# EAGLE design CO2SN v2 (EAGLE 9.6.2)
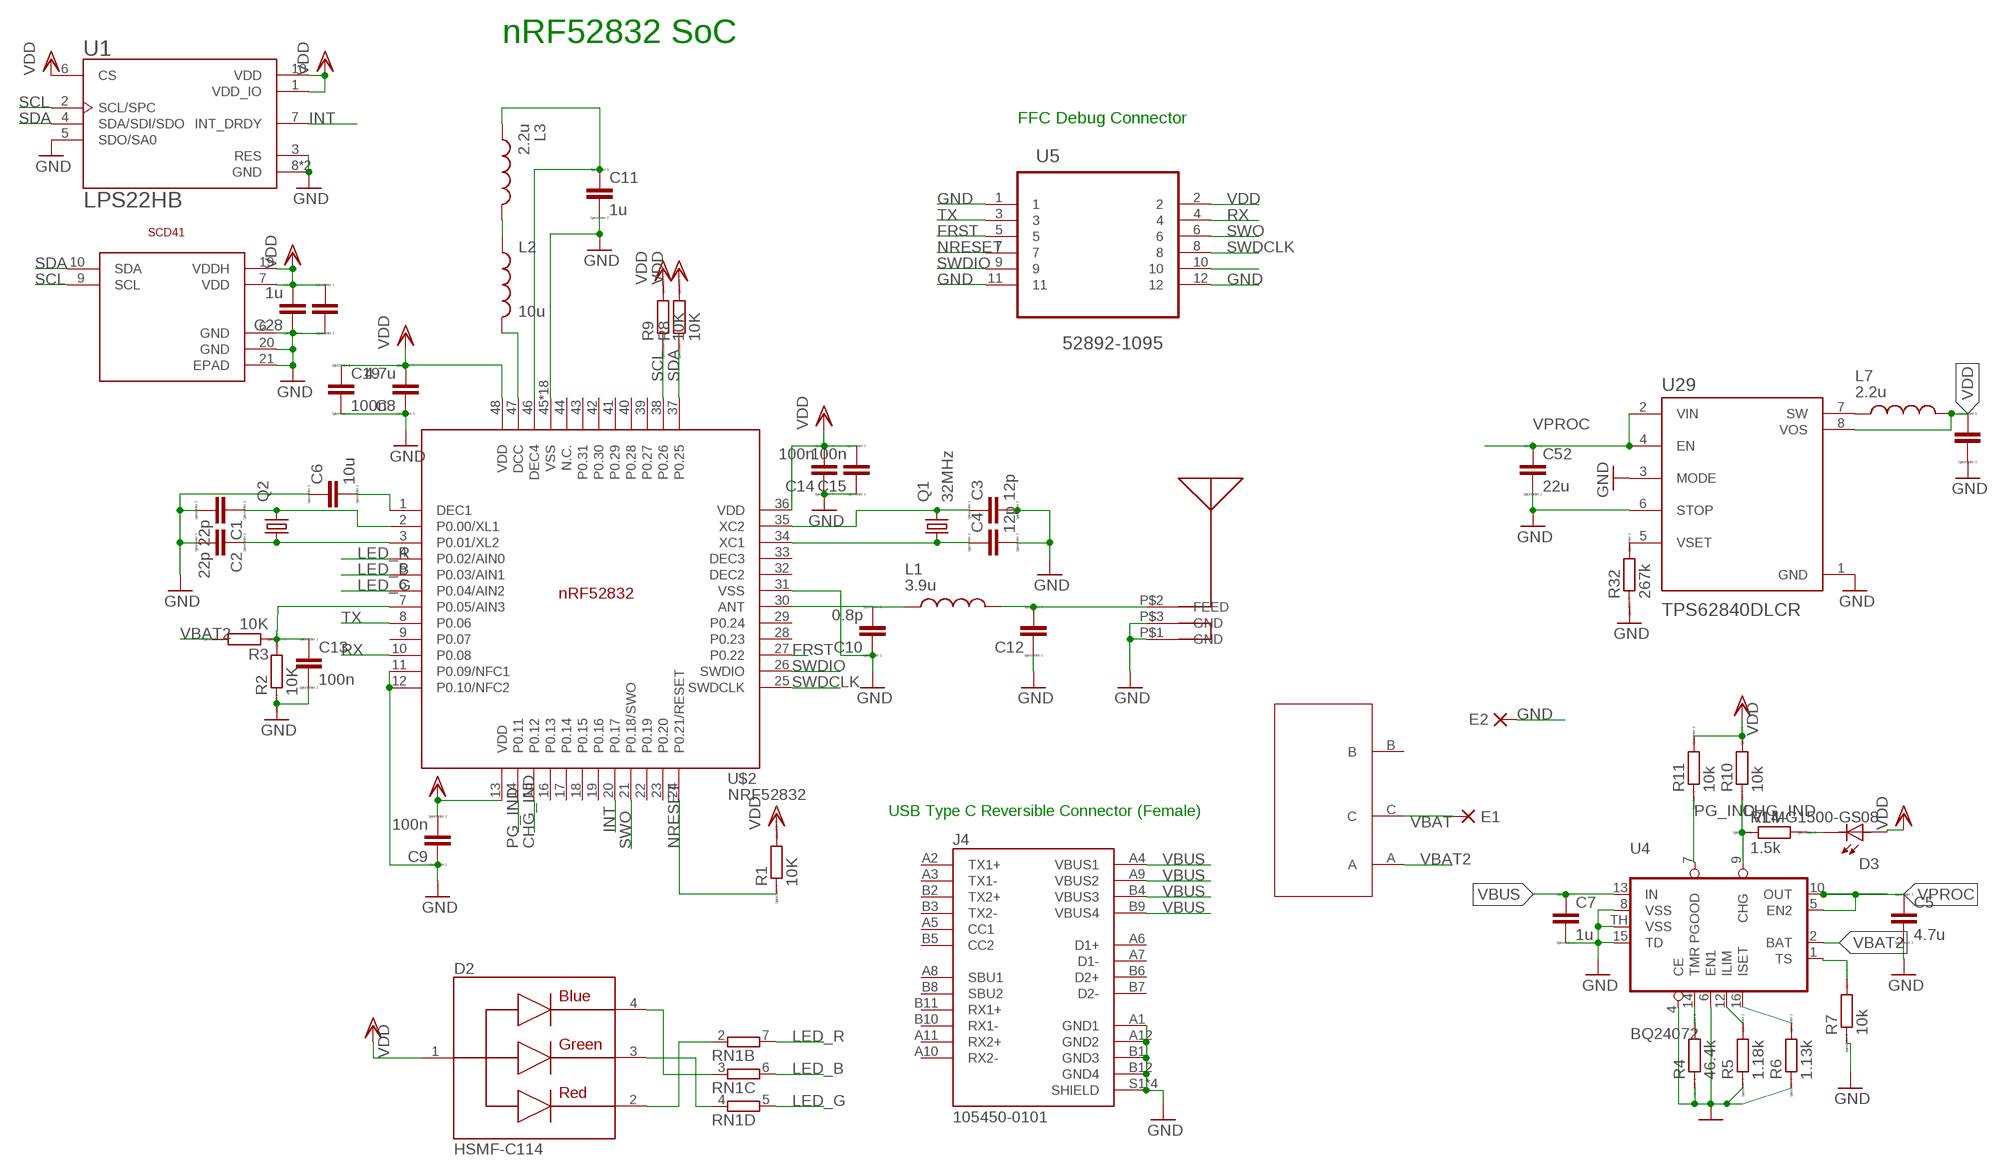
[diagram p0: schematic, sheet 1]

## Parts
C1  22p  CC0402  [C0402]
C2  22p  CC0402  [C0402]
C3  12p  CC0402  [C0402]
C4  12p  CC0402  [C0402]
C5  4.7u  CC0402  [C0402]
C6  10u  CC0402  [C0402]
C7  1u  CC0402  [C0402]
C8  4.7u  CC0402  [C0402]
C9  100n  CC0603R  [C0603R]
C10  0.8p  CC0402  [C0402]
C11  1u  CC0402  [C0402]
C12  1.2p  CC0402  [C0402]
C13  100n  CC0402  [C0402]
C14  100n  CC0402  [C0402]
C15  100n  CC0402  [C0402]
C19  100n  CC0402  [C0402]
C28  1u  CC0402  [C0402]
C29  22u  CC0603R  [C0603R]
C52  22u  CC0603R  [C0603R]
C58  22u  CC0603R  [C0603R]
D2  HSMF-C114  [DIOSC160X150X35-4N]
D3  VLMG1500-GS08  [LEDC1005X35N]
E1  DPADS_PAD-0400-S  [DPADS_0400-S]
E2  DPADS_PAD-0400-S  [DPADS_0400-S]
J4  105450-0101  [MOLEX_105450-0101]
L1  3.9u  MHQ0402P7N5JT000  [INDC0402X26N]
L2  10u  INDUCTOR  [L0603]
L3  2.2u  MHQ0402P7N5JT000  [INDC0402X26N]
L7  2.2u  1277AS-H-1R5M=P2  [INDC3225X120N]
Q1  32MHz  KX-5  [2.0X1.6_KX-5]
Q2  KX-327-RT  [2.0X1.2]
R1  10K  RR0402  [R0402]
R2  10K  RR0402  [R0402]
R3  10K  RR0402  [R0402]
R4  46.4k  RR0402  [R0402]
R5  1.18k  RR0402  [R0402]
R6  1.13k  RR0402  [R0402]
R7  10k  RR0402  [R0402]
R8  10K  RR0402  [R0402]
R9  10K  RR0402  [R0402]
R10  10k  RR0402  [R0402]
R11  10k  RR0402  [R0402]
R14  1.5k  RR0402  [R0402]
R32  267k  RR0402  [R0402]
RN1  4R-N0402ARV341  [4X0402ARV341]
U1  LPS22HB  [LGA10R50P2X3_200X200X80]
U4  BQ24072  [S-PVQFN-N16]
U5  52892-1095  [MOLEX_52892-1095]
U29  TPS62840DLCR  [SON50P200X150X100-8N]
U$1  SCD41  [SCD41]
U$2  NRF52832  [QFN40P600X600X90-48_N]
U$3  SMDTOGGLESWITCH  [SMDTOGGLESWITCH]
U$4  CHIPANTENNAL2  [CHIPANTENNAL2]

## Nets
CHG_IND: R10.1 R14.1 U4.9(CHG) U$2.15(P0.12)
FRST: U5.5 U$2.27(P0.22)
GND: C1.2 C2.2 C3.2 C4.2 C5.2 C6.1 C7.2 C8.1 C9.1 C10.1 C11.2 C12.1 C13.2 C14.1 C15.1 C19.2 C28.1 C29.2 C52.2 C58.2 E2.PAD(P) J4.A1(GND1) J4.A12(GND2) J4.B1(GND3) J4.B12(GND4) J4.S1(SHIELD) J4.S2(SHIELD) J4.S3(SHIELD) J4.S4(SHIELD) R2.1 R4.1 R5.1 R6.1 R7.1 R32.1 U1.3(RES) U1.5(SDO/SA0) U1.8(GND) U1.9(GND) U4.4(CE) U4.6(EN1) U4.8(VSS) U4.15(TD) U4.TH(VSS) U5.1 U5.11 U5.12 U29.1(GND) U29.3(MODE) U29.6(STOP) U$1.6(GND) U$1.20(GND) U$1.21(EPAD) U$2.11(P0.09/NFC1) U$2.12(P0.10/NFC2) U$2.31(VSS) U$2.45(VSS) U$2.PAD(VSS) U$2.PAD@VIA01(VSS) U$2.PAD@VIA02(VSS) U$2.PAD@VIA03(VSS) U$2.PAD@VIA04(VSS) U$2.PAD@VIA05(VSS) U$2.PAD@VIA06(VSS) U$2.PAD@VIA07(VSS) U$2.PAD@VIA08(VSS) U$2.PAD@VIA09(VSS) U$2.PAD@VIA10(VSS) U$2.PAD@VIA11(VSS) U$2.PAD@VIA12(VSS) U$2.PAD@VIA13(VSS) U$2.PAD@VIA14(VSS) U$2.PAD@VIA15(VSS) U$2.PAD@VIA16(VSS) U$4.P$1(GND) U$4.P$3(GND)
INT: U1.7(INT_DRDY) U$2.20(P0.17)
LED_B: RN1.6 U$2.5(P0.03/AIN1)
LED_G: RN1.5 U$2.6(P0.04/AIN2)
LED_R: RN1.7 U$2.4(P0.02/AIN0)
N$1: C1.1 Q2.2 U$2.2(P0.00/XL1)
N$2: C2.1 Q2.1 U$2.3(P0.01/XL2)
N$3: C3.1 Q1.3 U$2.35(XC2)
N$4: C4.1 Q1.1 U$2.34(XC1)
N$5: L2.2 U$2.47(DCC)
N$6: C10.2 L1.1 U$2.30(ANT)
N$7: C6.2 U$2.1(DEC1)
N$8: R4.2 U4.14(TMR)
N$9: R5.2 U4.12(ILIM)
N$10: L2.1 L3.2
N$11: C11.1 L3.1 U$2.46(DEC4)
N$12: R6.2 U4.16(ISET)
N$13: U5.10
N$14: D2.2 RN1.2
N$15: D3.2 R14.2
N$17: C13.1 R2.2 R3.1 U$2.7(P0.05/AIN3)
N$20: D2.3 RN1.4
N$21: D2.4 RN1.3
N$80: L7.1 U29.7(SW)
N$94: R32.2 U29.5(VSET)
NRESET: R1.1 U5.7 U$2.24(P0.21/RESET)
PG_IND: R11.1 U4.7(PGOOD) U$2.14(P0.11)
RF: C12.2 L1.2 U$4.P$2(FEED)
RX: U5.4 U$2.10(P0.08)
SCL: R9.1 U1.2(SCL/SPC) U$1.9(SCL) U$2.38(P0.26)
SDA: R8.1 U1.4(SDA/SDI/SDO) U$1.10(SDA) U$2.37(P0.25)
SWDCLK: U5.8 U$2.25(SWDCLK)
SWDIO: U5.9 U$2.26(SWDIO)
SWO: U5.6 U$2.21(P0.18/SWO)
TS: R7.2 U4.1(TS)
TX: U5.3 U$2.8(P0.06)
VBAT [PWRINFL]: E1.PAD(P) U$3.C
VBAT2: R3.2 U4.2(BAT) U$3.A
VBUS: C7.1 J4.A4(VBUS1) J4.A9(VBUS2) J4.B4(VBUS3) J4.B9(VBUS4) U4.13(IN)
VDD: C8.2 C9.2 C14.2 C15.2 C19.1 C28.2 C29.1 C58.1 D2.1 D3.1 L7.2 R1.2 R8.2 R9.2 R10.2 R11.2 U1.1(VDD_IO) U1.6(CS) U1.10(VDD) U5.2 U29.8(VOS) U$1.7(VDD) U$1.19(VDDH) U$2.13(VDD) U$2.36(VDD) U$2.48(VDD)
VPROC [NCLS3V7]: C5.1 C52.1 U4.5(EN2) U4.10(OUT) U29.2(VIN) U29.4(EN)
Unconnected: J4.A2(TX1+) J4.A3(TX1-) J4.A5(CC1) J4.A6(D1+) J4.A7(D1-) J4.A8(SBU1) J4.A10(RX2-) J4.A11(RX2+) J4.B2(TX2+) J4.B3(TX2-) J4.B5(CC2) J4.B6(D2+) J4.B7(D2-) J4.B8(SBU2) J4.B10(RX1-) J4.B11(RX1+) RN1.1 RN1.8 U$2.9(P0.07) U$2.16(P0.13) U$2.17(P0.14) U$2.18(P0.15) U$2.19(P0.16) U$2.22(P0.19) U$2.23(P0.20) U$2.28(P0.23) U$2.29(P0.24) U$2.32(DEC2) U$2.33(DEC3) U$2.39(P0.27) U$2.40(P0.28) U$2.41(P0.29) U$2.42(P0.30) U$2.43(P0.31) U$2.44(N.C.) U$3.B

## Notes on the sheet
- nRF52832 SoC
- FFC Debug Connector
- USB Type C Reversible Connector (Female)

## Library data of the parts
C1-C8 C10-C15 C19 C28 = eagle-ltspice:C: CAPACITOR, European symbol; SPICEMODEL: NONE; SPICEPREFIX: C
C9 C29 C52 C58 = eagle-ltspice:C: CAPACITOR, European symbol
D2 = HSMF-C114:HSMF-C114: LED Tri-Color Blue/Green/Red 468nm/523nm/637nm 4-Pin Chip LED T/R; AVAILABILITY: Unavailable; DESCRIPTION: LED RGB DIFFUSED CHIP SMD; MF: Broadcom Limited; MP: HSMF-C114; PACKAGE: 0606 Broadcom; PRICE: None
D3 = VLMG1500-GS08:VLMG1500-GS08: 0402 GREEN 571nm 35MCD 65° Rectangle with Flat Top SMT LED; AVAILABILITY: Unavailable; DESCRIPTION: 0402 GREEN 571nm 35MCD 65° Rectangle with Flat Top SMT LED; MF: Vishay; MP: VLMG1500-GS08; PACKAGE: 0402 Vishay; PRICE: None
E1 E2 = 52101-101-REV-A:DPADS_PAD: WIRE PAD Standard US Drill Sizes and SMD pads; BOM: EXCLUDE
J4 = 105450-0101:105450-0101: USB Shielded I/O Receptacle; Type C; Right Angle; Surface Mount; Gold over Nickel; AVAILABILITY: Unavailable; DESCRIPTION: USB-C (USB TYPE-C) USB 3.1 (USB 3.1 Gen 2, Superspeed+) Receptacle Connector 24 Position Surface Mount, Right Angle; Through Hole; MF: Molex; MP: 1054500101; PACKAGE: None; PRICE: None
L1 L3 = MHQ0402P7N5JT000:MHQ0402P7N5JT000: 221 NH 5% GOLD TERMINAL; AVAILABILITY: Unavailable; DESCRIPTION: FIXED IND 7.5NH 200MA 1.2 OHM; MF: TDK; MP: MHQ0402P7N5JT000; PACKAGE: 0402 TDK; PRICE: None
L2 = BeagleBone_Blue_R3:INDUCTOR: Inductors Basic Inductor/Choke - 0603 and 1206. Footprints are not proven and vary greatly between part numbers. SRN6045- 33uH, 20% 1.4A
L7 = 1277AS-H-1R5M_P2:1277AS-H-1R5M=P2: Ind Metal Alloy Shielded 1.5uH 20% 1MHz Powdered Iron 2.6A 1210 T/R Check prices <https://pricing.snapeda.com/parts/1277AS-H-1R5M%3DP2/Murata/view-part?ref=eda>; AVAILABILITY: Warning; DESCRIPTION: Inductor with Inductance: 1.5uH Tol. +/-20%, Package: 1210 (3225); MF: Murata; MP: 1277AS-H-1R5M=P2; PACKAGE: 1210 Murata; PRICE: None; PURCHASE-URL: https://pricing.snapeda.com/search/part/1277AS-H-1R5M=P2/?ref=eda
Q1 = crystal-geyer_V1_0:KX: Quartz Crystals (MHz) SMD: KX - Serie Model Size l/w/h [mm] Frequency Range Frequency Stability Temp. Range [°C] Load Capacitance AECQ 200 availabel Datasheet KX-4 KX-5 KX-6 KX-7 KX-9A KX-9B KX-12A KX-12B KX-13 KX-20 KX-K KX-KS 1.6/1.2/0.3 2.0/1.6/0.45 2.5/2.0/0.55 3.2/2.5/0.8 5.0/3.2/1.0 5.0/3.2/1.1 6.0/3.5/1.1 6.0/3.5/1.0 7.0/5.0 /1.3 11.6/5.5/1.6 12.3/4.5/4.2 12.3/4.5/3.2 24.0 ~ 80.0 MHz 16.0 ~ 80.0 MHz 12.0 ~ 80.0 MHz 8.0 ~ 60.0 MHz 7,68 ~ 300,0 MHz 8,0 ~ 50,0 MHz 8,0 ~ 150,0 MHz 8,0 ~ 50,0 MHz 6,0 ~ 160,0 MHz 3,579 ~ 25,0 MHz 3,579 ~ 70,0 MHz 3,579 ~ 70,0 MHz ±10 … ±50ppm ±10 … ±50ppm ±10 … ±50ppm ±10 … ±50ppm ±10 … ±50ppm ±10 … ±50ppm ±10 … ±50ppm ±10 … ±50ppm ±10 … ±50ppm ±50ppm ±10 … ±50ppm ±10 … ±50ppm (*) -40°C …+85°C (*) -40°C …+125°C (*) -40°C …+125°C (*) -40°C …+125°C (*) -40°C …+105°C (*) -40°C …+105°C (*) -40°C …+125°C (*) -40°C …+105°C (*) -40°C …+105°C (*) -40°C …+105°C (*) -40°C …+85°C (*) -40°C …+85°C 8, 8…16 8, 8…16 10, 8…16 12, 7…20 16, 10…20 16, 10…20 16, 10…20 16, 12…20 16, 12…20 16, 12…20 16, 12…30 16, 12…30 - yes yes yes - - - - - - - - KX-4.pdf <http://www.geyer-electronic.de/uploads/tx_userartikelfrequenz/GEYER-KX-4.pdf> KX-5.pdf <http://www.geyer-electronic.de/uploads/tx_userartikelfrequenz/GEYER-KX-5.pdf> KX-6.pdf <http://www.geyer-electronic.de/uploads/tx_userartikelfrequenz/GEYER-KX-6.pdf> KX-7.pdf <http://www.geyer-electronic.de/uploads/tx_userartikelfrequenz/GEYER-KX-7.pdf> KX-9A.pdf <http://www.geyer-electronic.de/uploads/tx_userartikelfrequenz/GEYER-KX-9A.pdf> KX-9B.pdf <http://www.geyer-electronic.de/uploads/tx_userartikelfrequenz/GEYER-KX-9B.pdf> KX-12A.pdf <http://www.geyer-electronic.de/uploads/tx_userartikelfrequenz/GEYER-KX-12A.pdf> KX-12B.pdf <http://www.geyer-electronic.de/uploads/tx_userartikelfrequenz/GEYER-KX-12B.pdf> KX-13.pdf <http://www.geyer-electronic.de/uploads/tx_userartikelfrequenz/GEYER-KX-13.pdf> KX-20.pdf <http://www.geyer-electronic.de/uploads/tx_userartikelfrequenz/GEYER-KX-20.pdf> KX-K.pdf <http://www.geyer-electronic.de/uploads/tx_userartikelfrequenz/GEYER-KX-K.pdf> KX-KS.pdf <http://www.geyer-electronic.de/uploads/tx_userartikelfrequenz/GEYER-KX-KS.pdf> <http://www.geyer-electronic.de/fileadmin/template/img/logo-geyer-electronic.png> Details see: http://www.geyer-electronic.de/Frequenz-Produkte.9.0.html Created 2016-06-07, Hans Locher 2016 (C) Geyer Quartz Technology KX4,KX5,KX6,KX7,KX9A,KX9B,KX12A,KX12B,KX13,KX20,KXK,KXKS;1612;2016;2520;3225;5032;6035;7050;11655;12345;1,6x1,2;2,0x1,6;2,5x2,0;3,2x2,5;5,0x3,2;6,0x3,5;7,0x5,0;11,6x5,5;12,3x4,5;12,3x4,5;1.6x1.2;2.0x1.6;2.5x2.0;3.2x2.5;5.0x3.2;6.0x3.5;7.0x5.0;11.6x5.5;12.3x4.5;12.3x4.5;
Q2 = crystal-geyer_V1_0:KX-327: Tuning Fork Crystals (kHz) SMD: KX327 - Serie Model Size l/w/h [mm] Frequency Range Frequency Stability Temp. Range [°C] Load Capacitance AECQ 200 availabel Datasheet KX-327VT KX-327FT KX-327RT KX-327NHT KX-327NHF KX-327L KX-327S 1.25/1.05/0.5 1.6/1.0/0.5 2.0/1.2/0.6 3.2/1.5/0.8 3.2/1.5/0.8 7.0/1.5/1.4 8.2/3.8/2.5 32,768 kHz 32,768 kHz 32,768 kHz 32,768 kHz 32,768 kHz 32,768 kHz 32,768 kHz ±10 … ±20ppm ±10 … ±20ppm ±10 … ±20ppm ±10 … ±20ppm ±10 … ±20ppm ±10 … ±20ppm ±5 … ±20ppm (*) -40°C …+85°C (*) -40°C …+85°C (*) -40°C …+85°C (*) -40°C …+85°C (*) -40°C …+125°C (*) -40°C …+85°C (*) -40°C …+85°C 7/9/12,5 7/9/12,5 7/9/12,6 7/9/12,5 9/12,5 7/9/12,5 6/12,5 - - - - yes - - KX-327VT.pdf <http://www.geyer-electronic.de/uploads/tx_userartikelfrequenz/GEYER-KX-327VT.pdf> KX-327FT.pdf <http://www.geyer-electronic.de/uploads/tx_userartikelfrequenz/GEYER-KX-327FT.pdf> KX-327RT.pdf <http://www.geyer-electronic.de/uploads/tx_userartikelfrequenz/GEYER-KX-327RT.pdf> KX-327NHT.pdf <http://www.geyer-electronic.de/uploads/tx_userartikelfrequenz/GEYER-KX-327NHT.pdf> KX-327NHF.pdf <http://www.geyer-electronic.de/uploads/tx_userartikelfrequenz/GEYER-KX-327NHF.pdf> KX-327L.pdf <http://www.geyer-electronic.de/uploads/tx_userartikelfrequenz/GEYER-KX-327L.pdf> KX-327S.pdf <http://www.geyer-electronic.de/uploads/tx_userartikelfrequenz/GEYER-KX-327S.pdf> <http://www.geyer-electronic.de/fileadmin/template/img/logo-geyer-electronic.png> Details see: http://www.geyer-electronic.de/Frequenz-Produkte.9.0.html Created 2016-06-07, Hans Locher 2016 (C) Geyer Quartz Technology KX327VT,KX327FT,KX327RT,KX327NHT,KX327NHF,KX327S,KX327L;125105;1610;2012;3215;7015;8238;1,25x1,05,1.25x1.05;1,6x1,0,1.6x1.0;2,0x1,2,2.0x1.2;3,2x1,5,3.2x1.5;8,2x3,8,8.2x3.8,7.0x1.5,7,0x1,532.768kHz
R1-R11 R14 R32 = eagle-ltspice:R: RESISTOR, European symbol; SPICEMODEL: NONE; SPICEPREFIX: R
RN1 = resistor-dil:4R-N: Array Chip Resistor Source: RS Component / Phycomp; OC_FARNELL: unknown; OC_NEWARK: unknown
U1 = LPS22HB:LPS22HB: MEMS nano pressure sensor: 260-1260 hPa absolute digital output barometer Check prices <https://pricing.snapeda.com/parts/LPS22HB/STMicroelectronics/view-part?ref=eda>; AVAILABILITY: No availability data; DESCRIPTION: Pressure Sensor 3.77PSI ~ 18.27PSI (26kPa ~ 126kPa) Absolute 24 b 10-WFLGA Exposed Pad; MF: STMicroelectronics; MP: LPS22HB; PACKAGE: WFLGA-10 STMicroelectronics; PRICE: None
U4 = Simplex-ICs:BQ24072: TI BQ24072 - Li battery charger and power path management ic
U5 = 52892-1095:52892-1095: CONNECTOR, FPC, ZIF, 0.50MM, 10 WAY; AVAILABILITY: Unavailable; DESCRIPTION: Socket, r/a, Fpc, Zif, Smt, 10way; MF: Molex; MP: 52892-1095; PACKAGE: None; PRICE: None
U29 = TPS62840DLCR:TPS62840DLCR: None Check prices <https://snapeda.com/parts/TPS62840DLCR/Texas%20Instruments/view-part/?ref=eda> Check prices <https://pricing.snapeda.com/parts/TPS62840DLCR/Texas%20Instruments/view-part?ref=eda>; AVAILABILITY: Warning; DESCRIPTION: 60-nA IQ, 1.8-V to 6.5-VIN, high-efficiency 750-mA step-down converter 8-VSON-HR -40 to 125; MF: Texas Instruments; MP: TPS62840DLCR; PACKAGE: VSON-HR-8 Texas Instruments; PRICE: None; PURCHASE-URL: https://pricing.snapeda.com/search/part/TPS62840DLCR/?ref=eda
U$1 = SCD41:SCD41
U$2 = Nordic_nRF:NRF52832: nRF52832 Features Single chip, highly flexible, 2.4 GHz multi-protocol SoC 32-bit ARM Cortex-M4F Processor 1.7v to 3.6v operation 512kB flash + 64kB RAM Supports concurrent Bluetooth Smart/ANT protocol operation On-chip NFC tag for Out-of-Band (OOB) pairing Up to +4dBm output power -96dBm sensitivity, Bluetooth Smart Thread safe and run-time protected Event driven API On air compatible with nRF24L and nRF24AP series 2 data rates (2Mbps/1Mbps) PPI - maximum flexibility for power-efficient applications and code simplification Automated power management system with automatic power management of each peripheral Configurable I/O mapping for analog and digital I/O 3 x Master/Slave SPI 2 x Two-wire interface (I²C) UART (RTS/CTS) 3 x PWM AES HW encryption Real Time Counter (RTC) Digital microphone interface (PDM) On-chip balun Applications Internet of Things (IoT) Wearables SmartHome sensors Connected white goods Computer peripherals Voice-command smart remotes A4WP ‘Rezence’ wireless charging Beacons Sports and fitness sensors and hubs Connected health products Smart watches RC Toys Interactive games Building automation and sensor networks
U$3 = smdtoggleswitch:SMDTOGGLESWITCH
U$4 = CHIPANTENNA:CHIPANTENNAL2

## Board
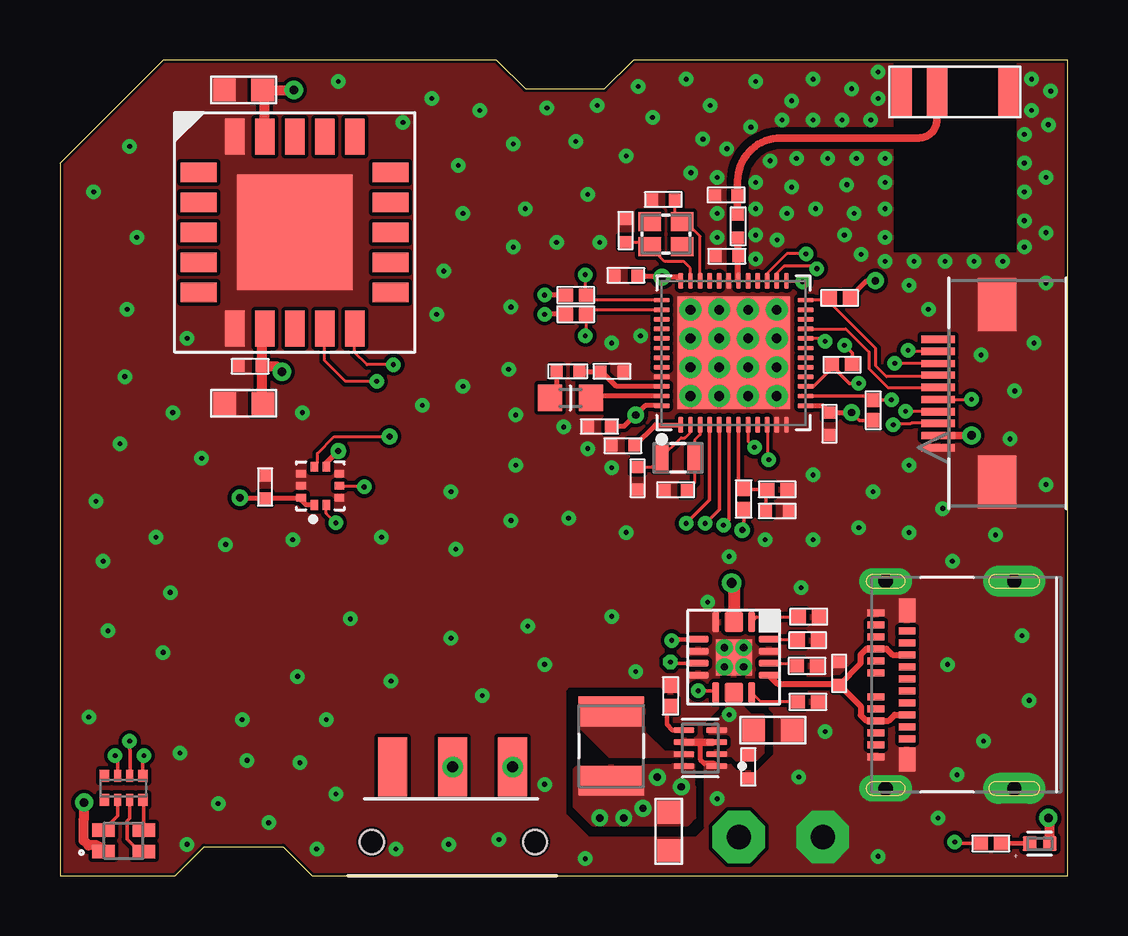
[diagram p1: board, top side]
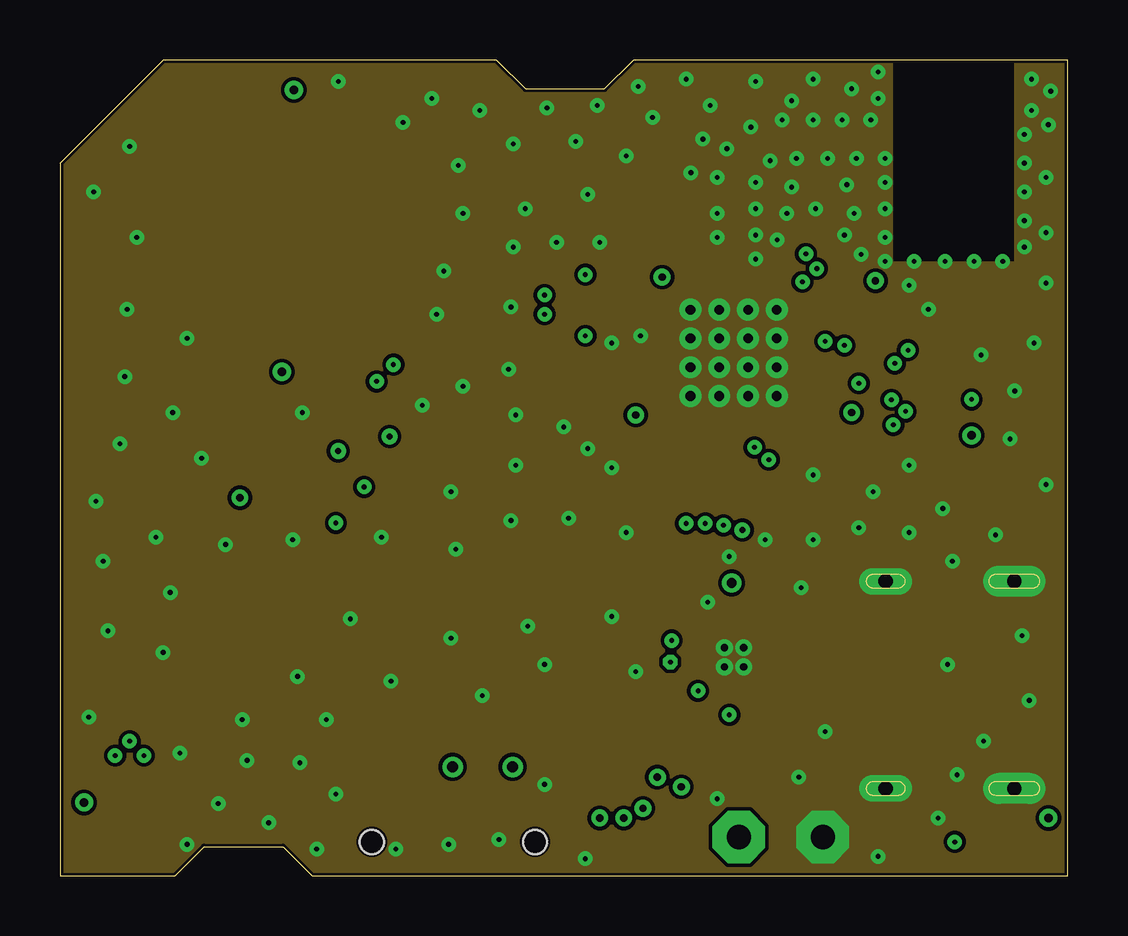
[diagram p2: board, inner layer Route2]
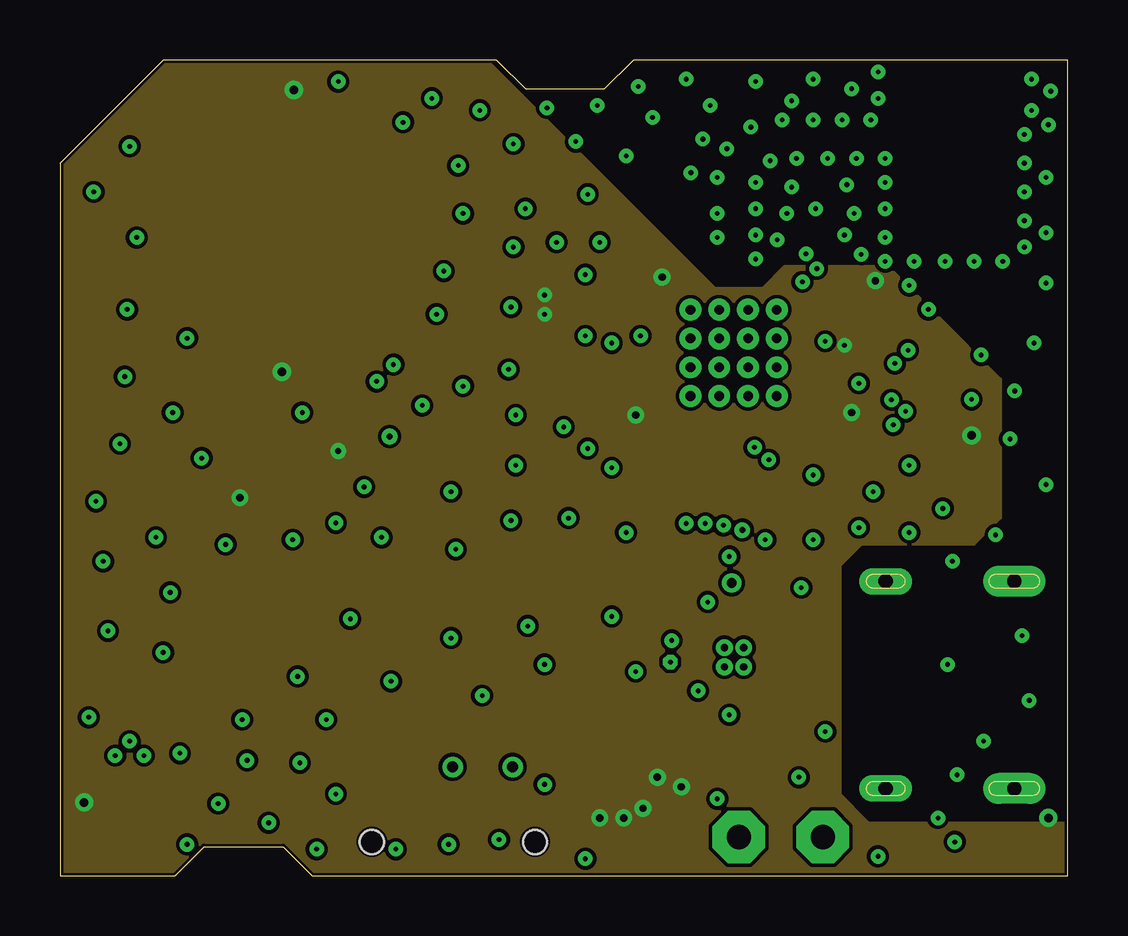
[diagram p3: board, inner layer Route15]
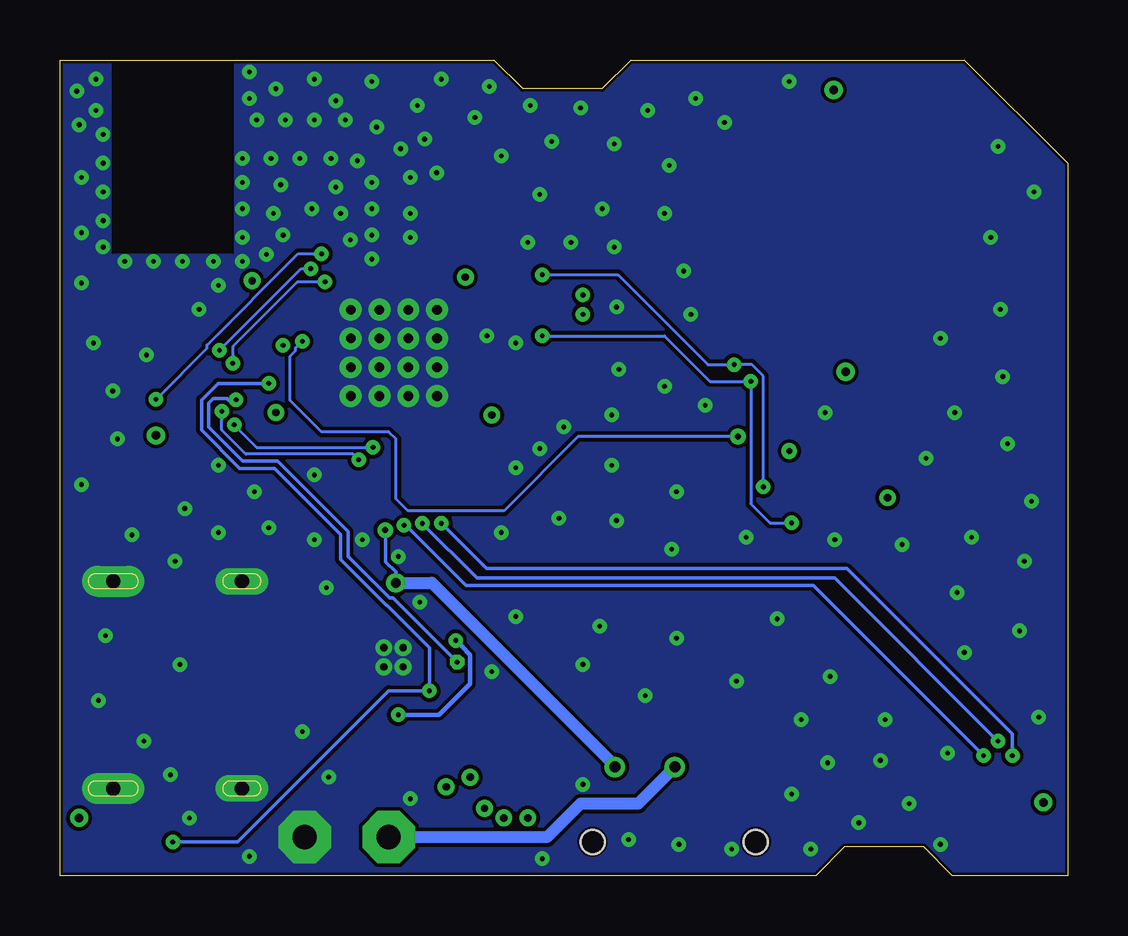
[diagram p4: board, bottom side, seen from below]

Size 42 x 34 mm. Coordinates in mm from the lower left corner, seen from the top.
Outline: 42,0 42,34 23.9,34 22.7,32.8 19.4,32.8 18.2,34 4.3,34 0,29.7 0,0 4.8,0 6,1.2 9.3,1.2 10.5,0 42,0
Copper layers (1+2*15+16): Top 0.035mm / dielectric 0.2mm / Route2 0.035mm / dielectric 0.45mm / Route15 0.035mm / dielectric 0.2mm / Bottom 0.035mm
Design rules "default *": minimum track width 5mil, minimum drill 0.2mm, track to track 6mil, track to pad 6mil, pad to pad 6mil, via to via 6mil, smd to smd 6mil, copper to edge 5mil, drill to drill 6mil, minimum pad ring 10mil, minimum via ring 8mil, stop-mask expansion 0mil, vias tented up to drill 40mil, thermal gap 0mil
tRestrict: 9 lines

### Footprints (pad centres in the part's own frame; a part is rotated, then mirrored left to right if it is on the bottom)
C0402 = smd 0.5 x 0.5: 1 -0.475,0; 2 0.475,0
C0603R = smd 0.95 x 0.95: 1 -0.85,0; 2 0.75,0
DIOSC160X150X35-4N = smd 0.94 x 0.57: 1 -0.845,-0.45; 2 -0.845,0.45; 3 0.845,0.45; 4 0.845,-0.45
LEDC1005X35N = smd 0.59 x 0.61: 1 -0.415,0; 2 0.415,0
DPADS_0400-S = drill 1.016 pad 2.184 octagon: PAD 0,0
MOLEX_105450-0101 = smd 0.3 x 0.7: A1 -3,3.77; A2 -2.5,3.77; A3 -2,3.77; A4 -1.5,3.77; A5 -1,3.77; A6 -0.5,3.77; A7 0.5,3.77; A8 1,3.77; A9 1.5,3.77; A10 2,3.77; A11 2.5,3.77; A12 3,3.77; B2 2.25,2.47; B3 1.75,2.47; B4 1.25,2.47; B5 0.75,2.47; B6 0.25,2.47; B7 -0.25,2.47; B8 -0.75,2.47; B9 -1.25,2.47; B10 -1.75,2.47; B11 -2.25,2.47 | smd 1 x 0.7: B1 3.1,2.47; B12 -3.1,2.47 | drill 0.6 pad 1.1 long: S1 -4.32,3.36; S2 4.32,3.36 | drill 0.6 pad 1.3 long: S3 -4.32,-2; S4 4.32,-2
INDC0402X26N = smd 0.5 x 0.5: 1 -0.732,0; 2 0.232,0
L0603 = smd 1 x 1.1: 1 -0.85,0; 2 0.85,0
INDC3225X120N = smd 1.24 x 2.72: 1 -1.44,0; 2 1.44,0
2.0X1.6_KX-5 = smd 0.95 x 0.8: 1 -0.675,-0.525; 2 0.675,-0.525; 3 0.675,0.525; 4 -0.675,0.525
2.0X1.2 = smd 0.6 x 1.1: 1 -0.7,0; 2 0.7,0
R0402 = smd 0.6 x 0.55: 1 -0.425,0; 2 0.425,0
4X0402ARV341 = smd 0.4 x 0.5: 1 -0.8,-0.5; 4 0.8,-0.5; 5 0.8,0.5; 8 -0.8,0.5 | smd 0.3 x 0.5: 2 -0.25,-0.5; 3 0.25,-0.5; 6 0.25,0.5; 7 -0.25,0.5
LGA10R50P2X3_200X200X80 = smd 0.4 x 0.3: 1 -0.8,0.25; 2 -0.8,-0.25; 6 0.8,-0.25; 7 0.8,0.25 | smd 0.3 x 0.4: 3 -0.5,-0.8; 4 0,-0.8; 5 0.5,-0.8; 8 0.5,0.8; 9 0,0.8; 10 -0.5,0.8
S-PVQFN-N16 = smd 0.85 x 0.28: 1 -0.725,2.225; 4 -0.725,0.725; 9 2.225,0.725; 12 2.225,2.225 | smd 0.85 x 0.78: 2 -0.725,1.475; 10 2.225,1.475 | smd 0.28 x 0.85: 5 0,0; 6 0.5,0; 7 1,0; 8 1.5,0; 13 1.5,2.95; 14 1,2.95; 15 0.5,2.95; 16 0,2.95 | smd 1.5 x 1.5: TH 0.75,1.475
MOLEX_52892-1095 = smd 0.305 x 1.397: 1 2.261,2.896; 2 1.753,2.896; 3 1.245,2.896; 4 0.762,2.896; 5 0.254,2.896; 6 -0.254,2.896; 7 -0.762,2.896; 8 -1.245,2.896; 9 -1.753,2.896; 10 -2.261,2.896 | smd 2.21 x 1.6: 11 -3.702,5.359; 12 3.702,5.359
SON50P200X150X100-8N = smd 0.86 x 0.27: 1 -0.685,0.75; 2 -0.685,0.25; 3 -0.685,-0.25; 4 -0.685,-0.75; 5 0.685,-0.75; 6 0.685,-0.25; 7 0.685,0.25; 8 0.685,0.75
SCD41 = smd 1.5 x 0.8: 1 0,0; 2 0,-1.25; 3 0,-2.5; 4 0,-3.75; 5 0,-5; 11 8,-5; 12 8,-3.75; 13 8,-2.5; 14 8,-1.25; 15 8,0 | smd 0.8 x 1.5: 6 1.5,-6.5; 7 2.75,-6.5; 8 4,-6.5; 9 5.25,-6.5; 10 6.5,-6.5; 16 6.5,1.5; 17 5.25,1.5; 18 4,1.5; 19 2.75,1.5; 20 1.5,1.5 | smd 4.8 x 4.8: 21 4,-2.5
QFN40P600X600X90-48_N = smd 0.65 x 0.2: 1 -3,2.2; 2 -3,1.8; 3 -3,1.4; 4 -3,1; 5 -3,0.6; 6 -3,0.2; 7 -3,-0.2; 8 -3,-0.6; 9 -3,-1; 10 -3,-1.4; 11 -3,-1.8; 12 -3,-2.2; 25 3,-2.2; 26 3,-1.8; 27 3,-1.4; 28 3,-1; 29 3,-0.6; 30 3,-0.2; 31 3,0.2; 32 3,0.6; 33 3,1; 34 3,1.4; 35 3,1.8; 36 3,2.2 | smd 0.2 x 0.65: 13 -2.2,-3; 14 -1.8,-3; 15 -1.4,-3; 16 -1,-3; 17 -0.6,-3; 18 -0.2,-3; 19 0.2,-3; 20 0.6,-3; 21 1,-3; 22 1.4,-3; 23 1.8,-3; 24 2.2,-3; 37 2.2,3; 38 1.8,3; 39 1.4,3; 40 1,3; 41 0.6,3; 42 0.2,3; 43 -0.2,3; 44 -0.6,3; 45 -1,3; 46 -1.4,3; 47 -1.8,3; 48 -2.2,3 | smd 4.7 x 4.7: PAD 0,0 | drill 0.4: PAD@VIA01 -1.8,1.8; PAD@VIA02 -1.8,0.6; PAD@VIA03 -1.8,-0.6; PAD@VIA04 -1.8,-1.8; PAD@VIA05 -0.6,1.8; PAD@VIA06 -0.6,0.6; PAD@VIA07 -0.6,-0.6; PAD@VIA08 -0.6,-1.8; PAD@VIA09 0.6,1.8; PAD@VIA10 0.6,0.6; PAD@VIA11 0.6,-0.6; PAD@VIA12 0.6,-1.8; PAD@VIA13 1.8,1.8; PAD@VIA14 1.8,0.6; PAD@VIA15 1.8,-0.6; PAD@VIA16 1.8,-1.8
SMDTOGGLESWITCH = smd 2.45 x 1.2: A 1.37,3.77; B 1.37,-1.23; C 1.37,1.27 | hole 1: 4.5,4.7; 4.5,-2.1
CHIPANTENNAL2 = smd 0.85 x 2: P$1 0.45,1; P$2 1.925,1; P$3 4.9,1

### Placement (x,y rotation side)
C1  24.08,16.56 270 top
C2  25.67,16.08 180 top
C3  23.58,26.89 90 top
C4  25.15,28.18 180 top
C5  28.69,4.53 270 top
C6  23.47,17.92 0 top
C7  32.48,8.43 90 top
C8  23.59,25.02 0 top
C9  7.71,19.68 0 top
C10  27.8,25.82 0 top
C11  23.01,21.02 0 top
C12  27.77,28.37 0 top
C13  29.9,15.2 0 top
C14  32.08,18.83 90 top
C15  22.49,18.72 0 top
C19  7.93,21.23 180 top
C28  8.55,16.2 270 top
C29  7.6,32.75 180 top
C52  29.77,6.06 0 top
C58  25.38,1.79 270 top
D2  2.65,1.45 0 top
D3  40.84,1.33 180 top
E1  28.3,1.6 0 top
E2  31.8,1.6 270 top
J4  37.78,7.95 90 top
L1  28.27,27.32 90 top
L2  21.28,19.91 0 top
L3  20.92,21.02 180 top
L7  22.98,5.4 270 top
Q1  25.26,26.74 180 top
Q2  25.76,17.42 180 top
R1  32.5,24.08 0 top
R2  29.9,16.1 180 top
R3  28.5,15.7 270 top
R4  31.14,8.74 180 top
R5  31.18,7.24 180 top
R6  31.17,9.81 180 top
R7  31.21,10.79 180 top
R8  21.5,24.2 180 top
R9  21.5,23.4 180 top
R10  32.6,21.3 0 top
R11  33.9,19.4 270 top
R14  38.8,1.34 0 top
R32  25.45,7.49 270 top
RN1  2.65,3.65 0 top
U1  10.85,16.25 90 top
U4  26.61,9.85 270 top
U5  33.7,20.1 270 top
U29  26.69,5.31 180 top
U$1  5.79,29.31 0 top
U$2  28.08,21.79 90 top
U$3  15.1,5.9 270 top
U$4  34.63,31.67 0 top

### Tracks (layer width: path | path; a pad name or v marks a point on that pad's centre or on a via)
CHG_IND  (via drill 0.2)
  Top 0.15: v33.3,20.52 32.91,20.52 32.5,20.93 32.5,20.98 R10.1 32.17,21.16 31.38,20.36 31.11,20.36 U$2.15
  Top 0.152: R14.1 37.36,1.34 v37.3,1.4 | v26.6,7.7 27.26,7.7 U4.9
  Bottom 0.15: v26.6,7.7 26.6,9.5 28.37,11.27 28.39,11.27 30.3,13.18 30.3,14.22 33.05,16.98 34.5,16.98 36.1,18.58 36.1,19.82 35.41,20.52 v33.3,20.52
  Bottom 0.152: v37.3,1.4 34.6,1.4 28.3,7.7 v26.6,7.7
FRST  (via drill 0.2)
  Top 0.127: U5.5 v38,19.85 | U$2.27 29.46,24.81 29.46,25.09 30.31,25.93 31.09,25.93 v31.1,25.92
  Bottom 0.127: v38,19.85 35.87,21.98 35.87,22.11 32.06,25.92 v31.1,25.92
GND  (via drill 0.2, 0.3)
  Top 0.2: U29.3 27.2,5.56 26.6,5.56 | U29.6 26.6,5.56 | U29.1 27.26,4.67 26.86,4.67 26.69,4.84 26.69,5.47 26.6,5.56
  Top 0.305: U29.6 27.2,5.56
  other vias: 29,25.7 29,26.7 27.4,26.6 29,27.8 27.4,27.6 27.4,29.1 29,28.9 29.6,29.8 27.8,30.3 28.8,31.2 30.7,29.9 30.1,31.5 31.4,31.5 32.6,31.5 32,29.9 33.2,29.9 33.8,31.5 34.4,29.9 34.4,28.9 34.4,27.8 34.4,26.6 34.4,25.6 35.6,25.6 36.9,25.6 38.1,25.6 39.3,25.6 40.2,26.2 40.2,27.3 40.2,28.5 40.2,29.7 40.2,30.9 40.5,31.9 40.5,33.2 34.1,32.4 34.1,33.5 33.4,25.9 33.1,27.6 41.1,26.8 32.7,26.7 41.2,31.3 41.1,29.1 30.3,27.6 32.8,28.8 41.3,32.7 33,32.8 35.4,24.6 31.4,33.2 29,33.1 27.1,32.1 30.5,28.7 26.3,29.3 26.1,33.2 23.6,30 31.5,27.8 36.2,23.6 41.1,24.7 29.9,26.5 30.5,32.3 24.2,22.5 22.5,26.4 22,28.4 21.5,30.6 19.4,27.8 22.4,32.1 24.1,32.9 20.3,32 20.7,26.4 18.9,30.5 31.4,16.7 33.3,14.5 38.4,21.7 41.1,16.3 39.8,20.2 39.6,18.2 36.8,15.3 19,19.2 40.6,22.2 23,22.2 23,17 33.9,16 35.4,14.3 23.6,14.3 30.9,12 35.4,17.1 39,14.2 31.4,14 22,17.8 21,18.7 29.4,14 31.9,6 27,11.4 27.9,13.3 23,10.8 24,8.5 30.8,4.1 38.5,5.6 37,8.8 26.8,30.7 24.7,31.6 18.7,21.1 18.9,26.2 21.2,14.9 16.8,20.4 37.2,13.1 15.7,23.4 37.4,4.2 36.6,2.4 1.5,15.6 16.8,27.6 34.1,0.8 40.1,10 15.1,19.6 17.5,31.9 15.5,32.4 11.6,33.1 18.8,23.7 19,17.1 16,25.2 18.8,14.8 16.3,16 9.7,14 13.4,14.1 6.9,13.8 4,14.1 10.1,19.3 5.9,17.4 2.5,18 4.7,19.3 2.7,20.8 2.8,23.6 1.4,28.5 2.9,30.4 3.2,26.6 27.4,3.2 20.2,3.8 40.4,7.3 14,1.1 1.2,6.6 18.3,1.5 17.6,7.5 5.3,22.4 1.8,13.1 5,5.1 16.5,13.6 21.9,0.7 16.2,1.3 8.7,2.2 10.7,1.1 10,4.7 11.5,3.4 20.2,8.8 5.3,1.3 13.8,8.1 11.1,6.5 7.8,4.8 6.6,3 2,10.2 7.6,6.5 4.6,11.8 9.9,8.3 16.3,9.9 12.1,10.7 19.5,10.4 4.3,9.3 28.5,9.5 28.5,8.7 27.7,8.7 27.7,9.5 14.3,31.4 16.6,29.6
  pour Top: 26.5,5.5 25.5,5.5 25.15,5.85 25.15,10.95 29.1,10.95 29.45,10.6 29.45,7.05 28.95,7.05 28.75,7.25 28.75,8.15 28.6,8.3 27.5,8.3 27.4,8.2 27.4,6.95 26.75,6.3 26.75,5.75
  pour Top: 26.9,2.05 26.9,4.6 27.95,4.6 28.2,4.35 29.1,4.35 29.8,5.05 29.8,6.75 29.3,7.25 28.95,7.25 28.95,10.95 41.95,10.95 41.95,-0.1 29.05,-0.1
  pour Top: 26.9,1.95 26.5,1.55 22.05,1.55 21.05,2.55 21.05,7.75 21.2,7.9 25.05,7.9 25.15,7.8 25.15,10.95 -0.1,10.95 -0.1,0.25 0.35,-0.2 36.95,-0.2 34.8,1.95
  pour Top: 42.05,10.8 42.05,25.9 34.7,25.9 34.7,34.1 0.05,34.1 0.05,10.8 0.1,10.75 42,10.75
  pour Top: 39.95,25.3 39.95,33.95 42.05,33.95 42.05,25.3
  pour Route2: -0.05,33.95 34.65,33.95 34.65,25.55 39.85,25.55 39.85,33.95 41.95,33.95 41.95,-0.1 36.9,-0.1 27.95,-9.05 -0.05,-9.05
  pour Bottom: 0.1,34.1 34.7,34.1 34.7,25.85 39.9,25.85 39.9,34 42.2,34 42.2,-0.1 0.1,-0.1
INT  (via drill 0.2, 0.25)
  Top 0.127: U1.7 10.73,17.18 10.73,17.6 11.43,18.3 v13.74,18.3 | v31.9,22.27 31.78,22.39 U$2.20
  Bottom 0.127: v13.74,18.3 20.4,18.3 23.5,15.2 27.5,15.2 28,15.7 28,18.2 28.3,18.5 31.1,18.5 32.4,19.8 32.4,21.67 32.18,21.89 32.18,21.99 v31.9,22.27
LED_B  (via drill 0.2)
  Top 0.152: RN1.6 2.93,4.18 2.93,5.22 2.9,5.25 v2.9,5.6 | v26.9,14.68 27.48,15.26 U$2.5
  Bottom 0.152: v2.9,5.6 9.7,12.4 24.62,12.4 v26.9,14.68
LED_G  (via drill 0.2)
  Top 0.152: RN1.5 3.45,4.95 v3.5,5 | U$2.6 27.88,14.82 v27.66,14.6
  Bottom 0.152: v3.5,5 10.59,12.1 25.07,12.1 27.57,14.6 v27.66,14.6
LED_R  (via drill 0.2)
  Top 0.152: v2.3,5 2.4,4.9 RN1.7 | v26.1,14.68 27.08,15.66 U$2.4
  Bottom 0.152: v2.3,5 2.3,5.9 9.2,12.8 24.22,12.8 v26.1,14.68
N$1
  Top 0.127: U$2.2 26.28,18.48 26.05,18.25 25.89,18.25 Q2.2 24.68,17.04 C1.1
N$2
  Top 0.127: U$2.3 26.68,18.38 26.45,18.15 Q2.1 26.46,16.39 C2.1
N$3
  Top 0.127: U$2.35 26.28,25.32 26,25.6 25.2,25.6 Q1.3 24.39,26.41 C3.1
N$4
  Top 0.127: U$2.34 26.68,26.65 26.07,27.27 Q1.1 25.62,27.57 C4.1
N$5
  Top 0.2: U$2.47 22.21,19.99 L2.2
N$6
  Top 0.254: U$2.30 28.27,25.6 C10.2 | C10.2 | C10.2
  Top 0.305: C10.2 L1.1
N$7
  Top 0.2: C6.2 24.82,18.79 U$2.1
N$8
  Top 0.127: U4.14 30.61,8.85 R4.2
N$9
  Top 0.127: R5.2 29.22,7.24 U4.12
N$10
  Top 0.2: L3.2 20.69,20.17 L2.1
N$11
  Top 0.2: U$2.46 23.21,20.39 22.58,21.02 C11.1 L3.1
N$12
  Top 0.127: U4.16 30.7,9.85 R6.2
N$14
  Top 0.152: D2.2 2.4,2.5 RN1.2
N$15
  Top 0.178: R14.2 40.41,1.34 D3.2
N$17
  Top 0.15: C13.1 29.43,16.05 R2.2
  Top 0.152: U$2.7 28.28,16.34 R3.1 28.52,16.1 R2.2
N$20
  Top 0.152: D2.3 3.5,3.1 RN1.4
N$21
  Top 0.152: RN1.3 2.9,2.38 2.8,2.28 2.8,1.5 3.3,1 D2.4
N$80
  pour Top: 26.4,4.95 22.9,4.95 21.65,6.2 21.65,7.4 24.35,7.4 24.35,6 25.2,5.15 26.4,5.15
N$94
  Top 0.178: U29.5 25.54,6.06 25.3,6.3 25.3,6.92 R32.2
NRESET
  Top 0.127: R1.1 31.98,23.99 | 31.98,23.99 U$2.24 | U5.7 36.53,20.8 34.45,20.8 34,21.25 34,21.98 31.98,23.99
PG_IND  (via drill 0.2)
  Top 0.15: U4.7 25.49,8.85 v25.45,8.9 | v34.66,19.83 R11.1 33.73,19.99 U$2.14
  Bottom 0.15: v25.45,8.9 28.11,11.57 28.26,11.57 30,13.31 30,14.35 32.93,17.28 34.38,17.28 35.8,18.7 35.8,19.7 35.62,19.88 35.03,19.88 34.98,19.83 v34.66,19.83
RF
  Top 0.305: L1.2 28.25,27.58 C12.2 28.25,28.95 arc-90 30.05,30.75 35.8,30.75 arc90 36.55,31.5 U$4.P$2 arc-90 U$4.P$2
RX  (via drill 0.2)
  Top 0.127: U5.4 35.26,19.34 v35.25,19.35 | U$2.10 29.48,17.4 v29.55,17.33
  Bottom 0.127: v29.55,17.33 29.79,17.57 34.25,17.57 35.26,18.57 35.26,19 35.25,19.01 v35.25,19.35
SCL  (via drill 0.2)
  Top 0.127: U$2.38 22.11,23.59 R9.1 21.93,22.52 v21.9,22.5 | v13.2,20.6 11.9,20.6 11.04,21.46 U$1.9 | v11.5,14.7 11.1,15.1 U1.2
  Bottom 0.127: v21.9,22.5 16.8,22.5 14.9,20.6 v13.2,20.6 13.2,15.5 12.4,14.7 v11.5,14.7
SDA  (via drill 0.2)
  Top 0.127: U$2.37 22.14,23.99 R8.1 21.9,24.23 v21.9,25.05 | v13.9,21.3 12.8,21.3 12.29,21.81 U$1.10 | U1.4 12.63,16.25 v12.68,16.2
  Bottom 0.127: v21.9,25.05 18.75,25.05 15,21.3 v13.9,21.3 13.88,21.32 13.19,21.32 12.68,20.82 v12.68,16.2
SWDCLK  (via drill 0.2)
  Top 0.127: U5.8 v34.8,21.34 v34.8,21.35 | U$2.25 30.91,24.79 v30.95,24.75
  Bottom 0.127: v30.95,24.75 32.11,24.75 34.8,22.05 v34.8,21.35
SWDIO  (via drill 0.2)
  Top 0.127: U5.9 35.4,21.85 v35.35,21.9 | U$2.26 29.86,24.81 29.86,25.09 30.18,25.4 31.45,25.4 v31.55,25.3
  Bottom 0.127: v35.35,21.9 31.95,25.3 v31.55,25.3
SWO
  Top 0.127: U$2.21 32.76,22.79 33.72,21.83 33.72,21.13 34.5,20.35 U5.6
TS
  Top 0.127: U4.1 29.05,10.79 R7.2
TX  (via drill 0.2)
  Top 0.127: U5.3 35.49,18.86 35.47,18.83 34.78,18.83 v34.74,18.79 | v28.95,17.85 28.92,17.85 28.68,18.09 U$2.8
  Bottom 0.127: v34.74,18.79 33.8,17.85 v28.95,17.85
VBAT  (via drill 0.45)
  Bottom 0.508: U$3.C 17.9,3 20.3,3 21.7,1.6 E1.PAD
  other vias: 16.37,4.53
VBAT2  (via drill 0.25, 0.4, 0.45)
  Top 0.15: R3.2 28.5,14.46 v28.44,14.4
  Top 0.508: v28,12.2 28.09,12.12 U4.2
  Bottom 0.15: v28,12.2 28,12.65 28.43,13.08 28.43,14.39 v28.44,14.4
  Bottom 0.508: v28,12.2 26.5,12.2 18.87,4.57 U$3.A
  other vias: 18.87,4.53
VBUS
  Top 0.254: U4.13 29.91,8 32.44,8 C7.1 | C7.1 33.38,8.86 33.38,9.22 33.61,9.45 J4.A9 34.45,9.45 34.7,9.2 J4.B4 | C7.1 33.38,7.05 33.38,6.68 33.61,6.45 J4.A4 34.55,6.45 34.8,6.7 J4.B9
VDD  (via drill 0.2, 0.25, 0.3, 0.35)
  Top 0.15: R11.2 33.33,18.98 v33,19.3 | R10.2 33.02,21.77 v32.7,22.1
  Top 0.2: U$2.48 24.39,19.59 v24,19.2 23.52,18.72 C15.2 | U$2.36 25.72,24.95 v25.1,24.95 25.08,24.97 24.11,24.97 C8.2 | U1.6 11.1,17.2 v11.6,17.7 | R8.2 v20.2,24.2 | R9.2 v20.2,23.4
  Top 0.203: U$2.13 31.8,19.59 C14.2 v33,19.3 | R1.2 33.64,24.79 v33.99,24.79 | 9.95,15.75 8.57,15.75 C28.2 7.53,15.72 v7.5,15.75 | 9.95,15.75 U1.10 | U1.1 10.25,15.45 9.95,15.75
  Top 0.305: U5.2 v38,18.35
  Top 0.406: C19.1 8.41,22.68 U$1.7 | C19.1 9.02,21.23 v9.25,21 | C19.1 8.41,19.73 C9.2 | U$1.19 8.54,32.66 C29.1 v9.75,32.75 | D2.1 1.55,1.26 1.19,1.26 0.98,1.47 0.98,2.33 1,2.36 v1,3.05 | D3.1 41.26,2.35 v41.2,2.4
  other vias: 22.5,2.4 23.5,2.4 24.3,2.8 25.9,3.7 24.9,4.1
  pour Top: 21.6,4.6 25.5,4.6 25.55,4.65 26.4,4.65 26.4,3.75 26.45,3.7 26.45,2.4 26.15,2.1 22.2,2.1 21.45,2.85 21.45,4.45
  pour Route15: 0.1,0 0.1,29.8 4.3,34 17.8,34 27.3,24.5 29.3,24.5 30.2,25.4 30.3,25.4 34.5,25.4 36.5,23.4 39.2,20.7 39.2,14.9 38.1,13.8 33.4,13.8 32.5,12.9 32.5,7.3 32.5,3.4 33.6,2.3 33.7,2.2 42,2.2 42,0
VPROC  (via drill 0.2)
  Top 0.178: U4.5 25.55,9.85 v25.5,9.8
  Bottom 0.178: v25.5,9.8 25.27,9.57 25.26,9.57 24.9,9.21 24.9,8 26.2,6.7 v27.9,6.7
  pour Top: 27.1,5 27.1,6.15 27.8,6.85 27.8,7.9 28.4,7.9 28.4,7.1 28.8,6.7 29.3,6.7 29.3,5.1 29,4.8 28.2,4.8 28,5